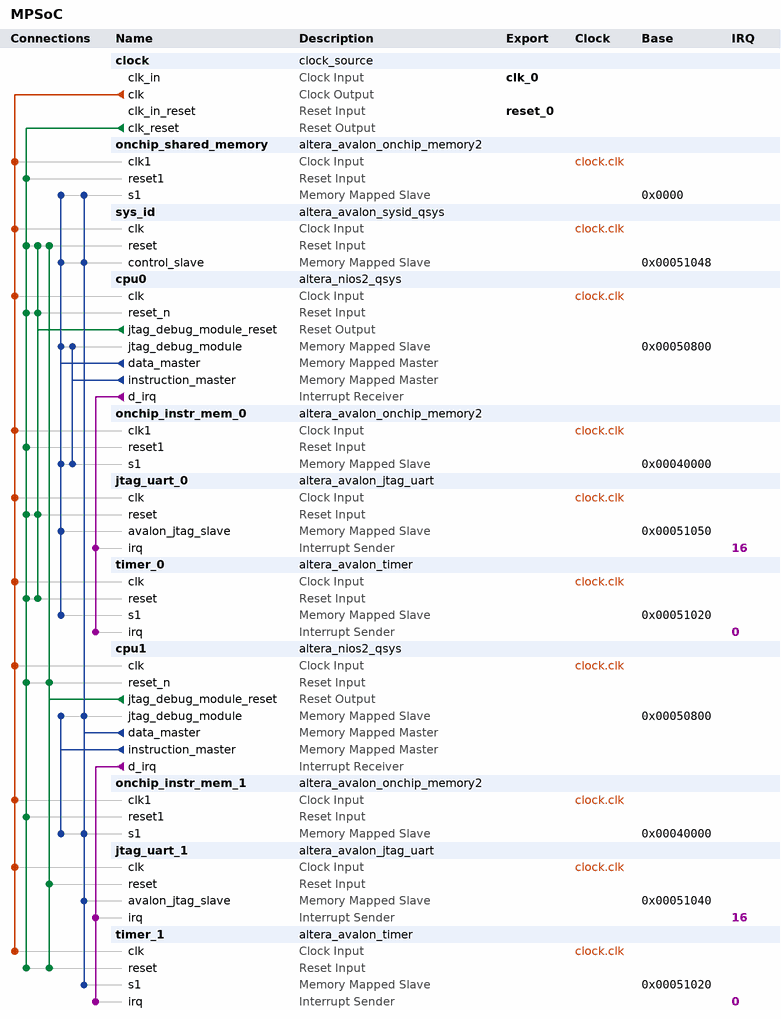
[diagram p0: system contents]
# Platform Designer (Qsys) system MPSoC, Cyclone IV E EP4CE115F29C7
# Parameters at their usual value, and those the tool derives, are not listed.
package require -exact qsys 13.1
create_system MPSoC
set_project_property DEVICE_FAMILY {Cyclone IV E}
set_project_property DEVICE EP4CE115F29C7

add_instance clock clock_source 13.1
set_instance_parameter_value clock clockFrequency 50000000

add_instance onchip_shared_memory altera_avalon_onchip_memory2 13.1
set_instance_parameter_value onchip_shared_memory dataWidth 32
set_instance_parameter_value onchip_shared_memory dualPort false
set_instance_parameter_value onchip_shared_memory initMemContent true
set_instance_parameter_value onchip_shared_memory initializationFileName onchip_mem.hex
set_instance_parameter_value onchip_shared_memory memorySize 262144

add_instance sys_id altera_avalon_sysid_qsys 13.1
set_instance_parameter_value sys_id id 1

add_instance cpu0 altera_nios2_qsys 13.1
set_instance_parameter_value cpu0 resetSlave onchip_instr_mem_0.s1
set_instance_parameter_value cpu0 mmu_TLBMissExcSlave None
set_instance_parameter_value cpu0 exceptionSlave onchip_instr_mem_0.s1
set_instance_parameter_value cpu0 breakSlave cpu0.jtag_debug_module
set_instance_parameter_value cpu0 impl Tiny
set_instance_parameter_value cpu0 icache_size 4096

add_instance onchip_instr_mem_0 altera_avalon_onchip_memory2 13.1
set_instance_parameter_value onchip_instr_mem_0 dataWidth 32
set_instance_parameter_value onchip_instr_mem_0 dualPort false
set_instance_parameter_value onchip_instr_mem_0 initMemContent true
set_instance_parameter_value onchip_instr_mem_0 initializationFileName onchip_mem.hex
set_instance_parameter_value onchip_instr_mem_0 memorySize 65536

add_instance jtag_uart_0 altera_avalon_jtag_uart 13.1
set_instance_parameter_value jtag_uart_0 simInteractiveOptions NO_INTERACTIVE_WINDOWS

add_instance timer_0 altera_avalon_timer 13.1
set_instance_parameter_value timer_0 period 1
set_instance_parameter_value timer_0 periodUnits MSEC

add_instance cpu1 altera_nios2_qsys 13.1
set_instance_parameter_value cpu1 resetSlave onchip_instr_mem_1.s1
set_instance_parameter_value cpu1 mmu_TLBMissExcSlave None
set_instance_parameter_value cpu1 exceptionSlave onchip_instr_mem_1.s1
set_instance_parameter_value cpu1 breakSlave cpu1.jtag_debug_module
set_instance_parameter_value cpu1 impl Tiny
set_instance_parameter_value cpu1 icache_size 4096

add_instance onchip_instr_mem_1 altera_avalon_onchip_memory2 13.1
set_instance_parameter_value onchip_instr_mem_1 dataWidth 32
set_instance_parameter_value onchip_instr_mem_1 dualPort false
set_instance_parameter_value onchip_instr_mem_1 initMemContent true
set_instance_parameter_value onchip_instr_mem_1 initializationFileName onchip_mem.hex
set_instance_parameter_value onchip_instr_mem_1 memorySize 65536

add_instance jtag_uart_1 altera_avalon_jtag_uart 13.1
set_instance_parameter_value jtag_uart_1 simInteractiveOptions NO_INTERACTIVE_WINDOWS

add_instance timer_1 altera_avalon_timer 13.1
set_instance_parameter_value timer_1 period 1
set_instance_parameter_value timer_1 periodUnits MSEC

# connections
add_connection clock.clk cpu0.clk clock
add_connection clock.clk cpu1.clk clock
add_connection clock.clk jtag_uart_0.clk clock
add_connection clock.clk jtag_uart_1.clk clock
add_connection clock.clk onchip_instr_mem_0.clk1 clock
add_connection clock.clk onchip_instr_mem_1.clk1 clock
add_connection clock.clk onchip_shared_memory.clk1 clock
add_connection clock.clk sys_id.clk clock
add_connection clock.clk timer_0.clk clock
add_connection clock.clk timer_1.clk clock
add_connection clock.clk_reset cpu0.reset_n reset
add_connection clock.clk_reset cpu1.reset_n reset
add_connection clock.clk_reset jtag_uart_0.reset reset
add_connection clock.clk_reset onchip_instr_mem_0.reset1 reset
add_connection clock.clk_reset onchip_instr_mem_1.reset1 reset
add_connection clock.clk_reset onchip_shared_memory.reset1 reset
add_connection clock.clk_reset sys_id.reset reset
add_connection clock.clk_reset timer_0.reset reset
add_connection clock.clk_reset timer_1.reset reset
add_connection cpu0.jtag_debug_module_reset cpu0.reset_n reset
add_connection cpu0.jtag_debug_module_reset jtag_uart_0.reset reset
add_connection cpu0.jtag_debug_module_reset sys_id.reset reset
add_connection cpu0.jtag_debug_module_reset timer_0.reset reset
add_connection cpu1.jtag_debug_module_reset cpu1.reset_n reset
add_connection cpu1.jtag_debug_module_reset jtag_uart_1.reset reset
add_connection cpu1.jtag_debug_module_reset sys_id.reset reset
add_connection cpu1.jtag_debug_module_reset timer_1.reset reset
add_connection cpu0.data_master cpu0.jtag_debug_module avalon
set_connection_parameter_value cpu0.data_master/cpu0.jtag_debug_module baseAddress 0x00050800
add_connection cpu0.data_master jtag_uart_0.avalon_jtag_slave avalon
set_connection_parameter_value cpu0.data_master/jtag_uart_0.avalon_jtag_slave baseAddress 0x00051050
add_connection cpu0.data_master onchip_instr_mem_0.s1 avalon
set_connection_parameter_value cpu0.data_master/onchip_instr_mem_0.s1 baseAddress 0x00040000
add_connection cpu0.data_master onchip_shared_memory.s1 avalon
set_connection_parameter_value cpu0.data_master/onchip_shared_memory.s1 baseAddress 0x0000
add_connection cpu0.data_master sys_id.control_slave avalon
set_connection_parameter_value cpu0.data_master/sys_id.control_slave baseAddress 0x00051048
add_connection cpu0.data_master timer_0.s1 avalon
set_connection_parameter_value cpu0.data_master/timer_0.s1 baseAddress 0x00051020
add_connection cpu0.instruction_master cpu0.jtag_debug_module avalon
set_connection_parameter_value cpu0.instruction_master/cpu0.jtag_debug_module baseAddress 0x00050800
add_connection cpu0.instruction_master onchip_instr_mem_0.s1 avalon
set_connection_parameter_value cpu0.instruction_master/onchip_instr_mem_0.s1 baseAddress 0x00040000
add_connection cpu1.data_master cpu1.jtag_debug_module avalon
set_connection_parameter_value cpu1.data_master/cpu1.jtag_debug_module baseAddress 0x00050800
add_connection cpu1.data_master jtag_uart_1.avalon_jtag_slave avalon
set_connection_parameter_value cpu1.data_master/jtag_uart_1.avalon_jtag_slave baseAddress 0x00051040
add_connection cpu1.data_master onchip_instr_mem_1.s1 avalon
set_connection_parameter_value cpu1.data_master/onchip_instr_mem_1.s1 baseAddress 0x00040000
add_connection cpu1.data_master onchip_shared_memory.s1 avalon
set_connection_parameter_value cpu1.data_master/onchip_shared_memory.s1 baseAddress 0x0000
add_connection cpu1.data_master sys_id.control_slave avalon
set_connection_parameter_value cpu1.data_master/sys_id.control_slave baseAddress 0x00051048
add_connection cpu1.data_master timer_1.s1 avalon
set_connection_parameter_value cpu1.data_master/timer_1.s1 baseAddress 0x00051020
add_connection cpu1.instruction_master cpu1.jtag_debug_module avalon
set_connection_parameter_value cpu1.instruction_master/cpu1.jtag_debug_module baseAddress 0x00050800
add_connection cpu1.instruction_master onchip_instr_mem_1.s1 avalon
set_connection_parameter_value cpu1.instruction_master/onchip_instr_mem_1.s1 baseAddress 0x00040000
add_connection cpu0.d_irq jtag_uart_0.irq interrupt
set_connection_parameter_value cpu0.d_irq/jtag_uart_0.irq irqNumber 16
add_connection cpu0.d_irq timer_0.irq interrupt
set_connection_parameter_value cpu0.d_irq/timer_0.irq irqNumber 0
add_connection cpu1.d_irq jtag_uart_1.irq interrupt
set_connection_parameter_value cpu1.d_irq/jtag_uart_1.irq irqNumber 16
add_connection cpu1.d_irq timer_1.irq interrupt
set_connection_parameter_value cpu1.d_irq/timer_1.irq irqNumber 0

# exported interfaces
add_interface clk_0 clock sink
set_interface_property clk_0 EXPORT_OF clock.clk_in
add_interface reset_0 reset sink
set_interface_property reset_0 EXPORT_OF clock.clk_in_reset

set_interconnect_requirement {$system} qsys_mm.clockCrossingAdapter HANDSHAKE
set_interconnect_requirement {$system} qsys_mm.maxAdditionalLatency 1
set_interconnect_requirement {$system} qsys_mm.insertDefaultSlave false

save_system MPSoC.qsys
